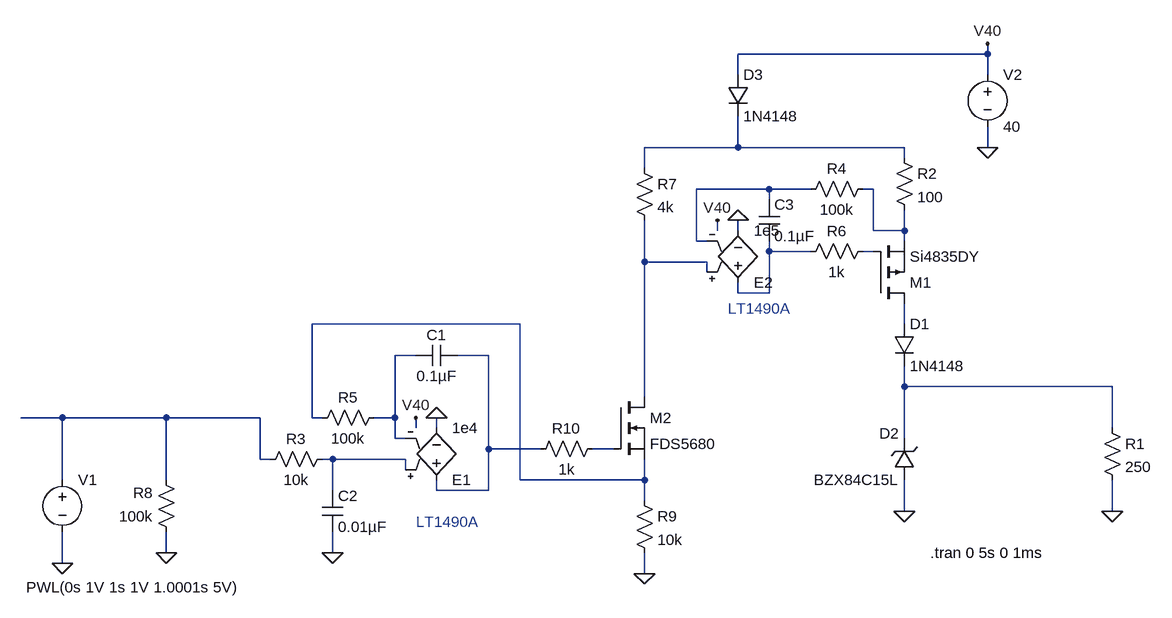
[diagram p0: schematic 4to20_Eblock.asc]
4to20_Eblock.asc, the LTspice schematic file:
Version 4
SHEET 1 3232 872
WIRE -48 -688 -48 -704
WIRE -48 -688 -432 -688
WIRE -432 -656 -432 -688
WIRE -48 -656 -48 -688
WIRE -432 -544 -432 -592
WIRE -432 -544 -576 -544
WIRE -176 -544 -432 -544
WIRE -48 -544 -48 -576
WIRE -176 -528 -176 -544
WIRE -576 -512 -576 -544
WIRE -384 -480 -496 -480
WIRE -320 -480 -384 -480
WIRE -224 -480 -240 -480
WIRE -384 -464 -384 -480
WIRE -464 -416 -464 -432
WIRE -432 -416 -432 -432
WIRE -224 -416 -224 -480
WIRE -176 -416 -176 -448
WIRE -176 -416 -224 -416
WIRE -496 -400 -496 -480
WIRE -480 -400 -496 -400
WIRE -176 -400 -176 -416
WIRE -384 -384 -384 -400
WIRE -320 -384 -384 -384
WIRE -224 -384 -240 -384
WIRE -576 -368 -576 -432
WIRE -480 -368 -576 -368
WIRE -480 -352 -480 -368
WIRE -432 -320 -432 -336
WIRE -384 -320 -384 -384
WIRE -384 -320 -432 -320
WIRE -768 -272 -1088 -272
WIRE -176 -272 -176 -304
WIRE -928 -224 -960 -224
WIRE -816 -224 -864 -224
WIRE -176 -176 -176 -208
WIRE 144 -176 -176 -176
WIRE -576 -160 -576 -368
WIRE -1472 -128 -1536 -128
WIRE -1312 -128 -1472 -128
WIRE -1168 -128 -1312 -128
WIRE -1088 -128 -1088 -272
WIRE -1072 -128 -1088 -128
WIRE -960 -128 -960 -224
WIRE -960 -128 -992 -128
WIRE -928 -112 -928 -128
WIRE -896 -112 -896 -128
WIRE 144 -112 144 -176
WIRE -960 -96 -960 -128
WIRE -944 -96 -960 -96
WIRE -176 -96 -176 -176
WIRE -816 -80 -816 -224
WIRE -736 -80 -816 -80
WIRE -624 -80 -656 -80
WIRE -1168 -64 -1168 -128
WIRE -1152 -64 -1168 -64
WIRE -1056 -64 -1072 -64
WIRE -944 -64 -1056 -64
WIRE -944 -48 -944 -64
WIRE -1472 -32 -1472 -128
WIRE -1312 -32 -1312 -128
WIRE -768 -32 -768 -272
WIRE -576 -32 -576 -64
WIRE -576 -32 -768 -32
WIRE -1056 -16 -1056 -64
WIRE -896 -16 -896 -32
WIRE -816 -16 -816 -80
WIRE -816 -16 -896 -16
WIRE -576 0 -576 -32
WIRE -176 16 -176 -32
WIRE 144 16 144 -32
WIRE -1312 80 -1312 48
WIRE -1056 80 -1056 48
WIRE -1472 96 -1472 48
WIRE -576 112 -576 80
FLAG 144 16 0
FLAG -48 -544 0
FLAG -896 -128 0
FLAG -48 -704 V40
FLAG -928 -128 V40
FLAG -1056 80 0
FLAG -1472 96 0
FLAG -1312 80 0
FLAG -176 16 0
FLAG -464 -432 V40
FLAG -576 112 0
FLAG -432 -432 0
SYMBOL res 128 -128 R0
SYMATTR InstName R1
SYMATTR Value 250
SYMBOL voltage -48 -672 R0
SYMATTR InstName V2
SYMATTR Value 40
SYMBOL res -976 -144 R90
WINDOW 0 0 56 VBottom 0
WINDOW 3 32 56 VTop 0
SYMATTR InstName R5
SYMATTR Value 100k
SYMBOL res -192 -544 R0
SYMATTR InstName R2
SYMATTR Value 100
SYMBOL cap -928 -208 R270
WINDOW 0 32 32 VTop 0
WINDOW 3 0 32 VBottom 0
SYMATTR InstName C1
SYMATTR Value 0.1µF
SYMBOL pmos -224 -304 M180
SYMATTR InstName M1
SYMATTR Value Si4835DY
SYMBOL cap -1072 -16 R0
SYMATTR InstName C2
SYMATTR Value 0.01µF
SYMBOL voltage -1472 -48 R0
WINDOW 123 0 0 Left 0
WINDOW 39 0 0 Left 0
WINDOW 3 -56 181 Left 0
SYMATTR Value PWL(0s 1V 1s 1V 1.0001s 5V)
SYMATTR InstName V1
SYMBOL diode -192 -272 R0
SYMATTR InstName D1
SYMATTR Value 1N4148
SYMBOL res -592 -528 R0
SYMATTR InstName R7
SYMATTR Value 4k
SYMBOL res -1296 64 R180
WINDOW 0 36 76 Left 0
WINDOW 3 36 40 Left 0
SYMATTR InstName R8
SYMATTR Value 100k
SYMBOL zener -160 -32 R180
WINDOW 0 24 72 Left 0
WINDOW 3 24 0 Left 0
SYMATTR InstName D2
SYMATTR Value BZX84C15L
SYMATTR Description Diode
SYMATTR Type diode
SYMBOL diode -448 -656 R0
SYMATTR InstName D3
SYMATTR Value 1N4148
SYMBOL res -224 -496 R90
WINDOW 0 0 56 VBottom 0
WINDOW 3 32 56 VTop 0
SYMATTR InstName R4
SYMATTR Value 100k
SYMBOL res -224 -400 R90
WINDOW 0 0 56 VBottom 0
WINDOW 3 32 56 VTop 0
SYMATTR InstName R6
SYMATTR Value 1k
SYMBOL cap -400 -464 R0
SYMATTR InstName C3
SYMATTR Value 0.1µF
SYMBOL nmos -624 -160 R0
SYMATTR InstName M2
SYMATTR Value FDS5680
SYMBOL res -592 -16 R0
SYMATTR InstName R9
SYMATTR Value 10k
SYMBOL res -1168 -48 R270
WINDOW 0 32 56 VTop 0
WINDOW 3 0 56 VBottom 0
SYMATTR InstName R3
SYMATTR Value 10k
SYMBOL e -896 -16 M180
SYMATTR InstName E1
SYMATTR Value 1e4
SYMBOL e -432 -320 M180
SYMATTR InstName E2
SYMATTR Value 1e5
SYMBOL res -640 -96 R90
WINDOW 0 0 56 VBottom 0
WINDOW 3 32 56 VTop 0
SYMATTR InstName R10
SYMATTR Value 1k
TEXT -136 80 Left 0 !.tran 0 5s 0 1ms
TEXT -928 32 Left 0 ;LT1490A
TEXT -448 -296 Left 0 ;LT1490A

The netlist it stands for:
* 4to20_Eblock.asc
R1 N011 0 250
V2 V40 0 40
R5 N009 N007 100k
R2 N001 N003 100
C1 N009 N010 0.1µF
M1 N008 N005 N003 N003 Si4835DY
C2 N014 0 0.01µF
V1 N012 0 PWL(0s 1V 1s 1V 1.0001s 5V)
D1 N008 N011 1N4148
R7 N001 N006 4k
R8 0 N012 100k
D2 0 N011 BZX84C15L
D3 V40 N001 1N4148
R4 N003 N002 100k
R6 N005 N004 1k
C3 N002 N004 0.1µF
M2 N006 N013 N007 N007 FDS5680
R9 N007 0 10k
R3 N012 N014 10k
E1 N010 0 N014 N009 1e4
E2 N004 0 N006 N002 1e5
R10 N013 N010 1k
.model D D
.lib standard.dio
.model NMOS NMOS
.model PMOS PMOS
.lib standard.mos
.tran 0 5s 0 1ms
* LT1490A
* LT1490A
.backanno
.end